# EAGLE design snarfbasebasics232-v03g (EAGLE 5.11)
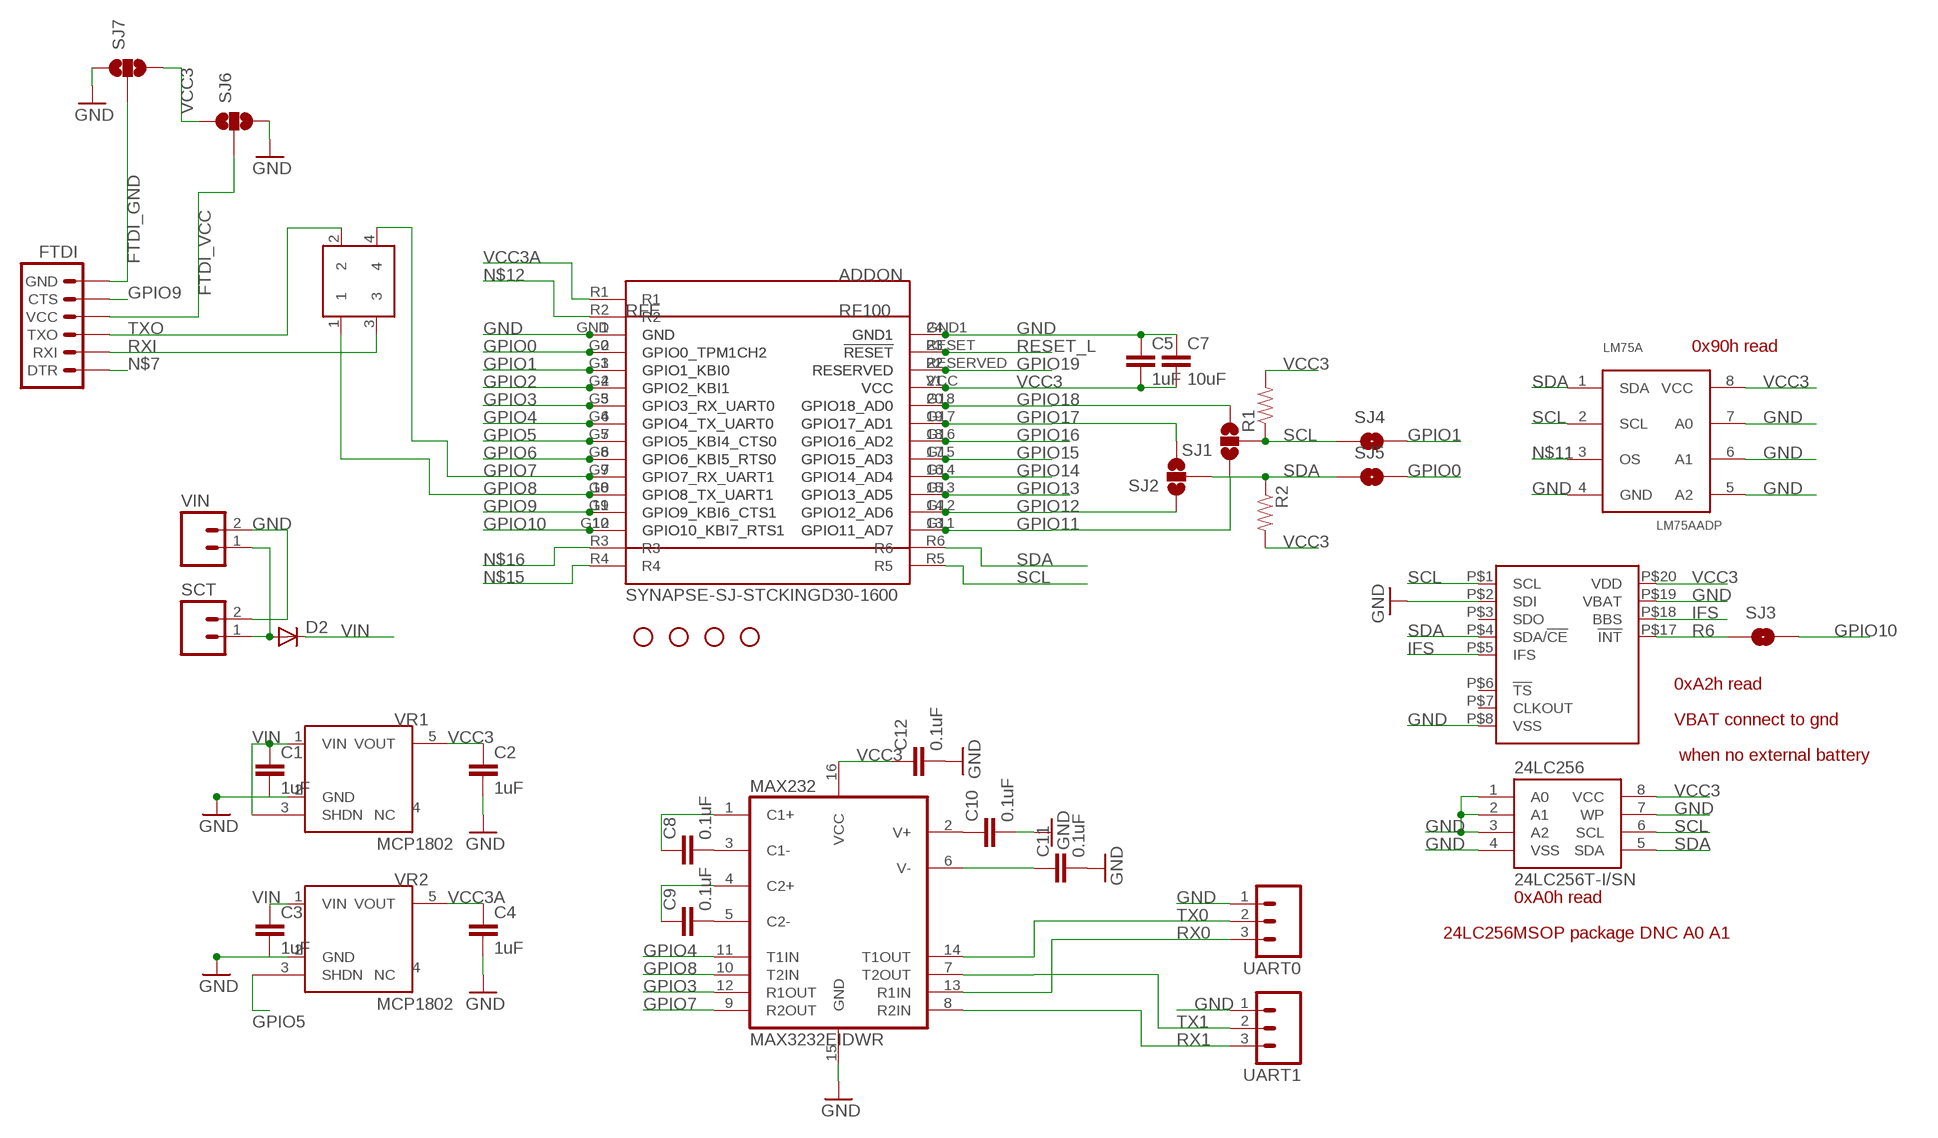
[diagram p0: schematic, sheet 1]

## Parts
24LC256  24LC256T-I/SN  EEPROM-I2CSMD  [SO08]
ADDON  SYNAPSE-SJ-STCKINGD30-1600  [SYNSJ-STACK]
C1  1uF  CAP0805  [0805]
C2  1uF  CAP0805  [0805]
C3  1uF  CAP0805  [0805]
C4  1uF  CAP0805  [0805]
C5  1uF  CAP0805  [0805]
C7  10uF  CAP0805  [0805]
C8  0.1uF  CAP0805  [0805]
C9  0.1uF  CAP0805  [0805]
C10  0.1uF  CAP0805  [0805]
C11  0.1uF  CAP0805  [0805]
C12  0.1uF  CAP0805  [0805]
D2  DIODESMA  [SMA-DIODE]
FTDI  ARDUINO_SERIAL_PROGRAMPTH  [1X06]
JP6  STAND-OFF  [STAND-OFF]
JP9  STAND-OFF  [STAND-OFF]
JP10  STAND-OFF  [STAND-OFF]
JP11  STAND-OFF  [STAND-OFF]
LM75A  LM75AADP  [TSSOP8]
MAX232  MAX3232EIDWR  MAX232SOIC16  [SO016]
PCF2129A  PCF2129ASO20  [SO20W]
R1  RESISTOR  [0805]
R2  RESISTOR  [0805]
RFE  RFE  RF100-JACKJACK2  [SYNAPSERFENGINE-THM-SMT-JACK2]
RXTX  SERIAL_CROSSOVER  [2X02_PTH]
SCT  M023.5MM  [SCREWTERMINAL-3.5MM-2]
SJ1  SOLDERJUMPER_2WAYS  [SJ_3]
SJ2  SOLDERJUMPER_2WAYS  [SJ_3]
SJ3  SOLDERJUMPERNC2  [SJ_2S-NOTRACE]
SJ4  SOLDERJUMPERNO  [SJ_2S-NO]
SJ5  SOLDERJUMPERNO  [SJ_2S-NO]
SJ6  SOLDERJUMPER_2WAYPASTE1&2  [SJ_3_PASTE1&2]
SJ7  SOLDERJUMPER_2WAYPASTE1&2  [SJ_3_PASTE1&2]
UART0  M03PTH  [1X03]
UART1  M03PTH  [1X03]
VIN  M02PTH  [1X02]
VR1  MCP1802  [SOT23-5]
VR2  MCP1802  [SOT23-5]

## Nets
FTDI_GND: FTDI.6(GND) SJ7.2
FTDI_VCC: FTDI.4(VCC) SJ6.2
GND: 24LC256.1(A0) 24LC256.2(A1) 24LC256.3(A2) 24LC256.4(VSS) 24LC256.7(WP) ADDON.GND ADDON.GND1 C1.2 C2.2 C3.2 C4.2 C5.1 C7.1 C10.2 C11.2 C12.2 LM75A.4(GND) LM75A.5(A2) LM75A.6(A1) LM75A.7(A0) MAX232.15(GND) PCF2129A.P$2(SDI) PCF2129A.P$8(VSS) PCF2129A.P$19(VBAT) RFE.1(GND) RFE.24(GND1) RFE.P1 RFE.P24 RFE.P201 RFE.P224 SCT.2 SJ6.3 SJ7.1 UART0.1 UART1.1 VIN.2 VR1.2(GND) VR2.2(GND)
GPIO0: ADDON.G0(GPIO0_TPM1CH2) RFE.2(GPIO0_TPM1CH2) RFE.P2 RFE.P202 SJ5.2
GPIO1: ADDON.G1(GPIO1_KBI0) RFE.3(GPIO1_KBI0) RFE.P3 RFE.P203 SJ4.2
GPIO2: ADDON.G2(GPIO2_KBI1) RFE.4(GPIO2_KBI1) RFE.P4 RFE.P204
GPIO3: ADDON.G3(GPIO3_RX_UART0) MAX232.12(R1OUT) RFE.5(GPIO3_RX_UART0) RFE.P5 RFE.P205
GPIO4: ADDON.G4(GPIO4_TX_UART0) MAX232.11(T1IN) RFE.6(GPIO4_TX_UART0) RFE.P6 RFE.P206
GPIO5: ADDON.G5(GPIO5_KBI4_CTS0) RFE.7(GPIO5_KBI4_CTS0) RFE.P7 RFE.P207 VR2.3(SHDN)
GPIO6: ADDON.G6(GPIO6_KBI5_RTS0) RFE.8(GPIO6_KBI5_RTS0) RFE.P8 RFE.P208
GPIO7: ADDON.G7(GPIO7_RX_UART1) MAX232.9(R2OUT) RFE.9(GPIO7_RX_UART1) RFE.P9 RFE.P209 RXTX.4
GPIO8: ADDON.G8(GPIO8_TX_UART1) MAX232.10(T2IN) RFE.10(GPIO8_TX_UART1) RFE.P10 RFE.P210 RXTX.1
GPIO9: ADDON.G9(GPIO9_KBI6_CTS1) FTDI.5(CTS) RFE.11(GPIO9_KBI6_CTS1) RFE.P11 RFE.P211
GPIO10: ADDON.G10(GPIO10_KBI7_RTS1) RFE.12(GPIO10_KBI7_RTS1) RFE.P12 RFE.P212 SJ3.2
GPIO11: ADDON.G11(GPIO11_AD7) RFE.13(GPIO11_AD7) RFE.P13 RFE.P213 SJ1.1
GPIO12: ADDON.G12(GPIO12_AD6) RFE.14(GPIO12_AD6) RFE.P14 RFE.P214 SJ2.1
GPIO13: ADDON.G13(GPIO13_AD5) RFE.15(GPIO13_AD5) RFE.P15 RFE.P215
GPIO14: ADDON.G14(GPIO14_AD4) RFE.16(GPIO14_AD4) RFE.P16 RFE.P216
GPIO15: ADDON.G15(GPIO15_AD3) RFE.17(GPIO15_AD3) RFE.P17 RFE.P217
GPIO16: ADDON.G16(GPIO16_AD2) RFE.18(GPIO16_AD2) RFE.P18 RFE.P218
GPIO17: ADDON.G17(GPIO17_AD1) RFE.19(GPIO17_AD1) RFE.P19 RFE.P219 SJ2.3
GPIO18: ADDON.G18(GPIO18_AD0) RFE.20(GPIO18_AD0) RFE.P20 RFE.P220 SJ1.3
GPIO19: ADDON.RESERVED RFE.22(RESERVED) RFE.P22 RFE.P222
IFS: PCF2129A.P$5(IFS) PCF2129A.P$18(BBS)
N$1: C8.2 MAX232.3(C1-)
N$2: D2.A SCT.1 VIN.1
N$4: C9.2 MAX232.5(C2-)
N$5: C10.1 MAX232.2(V+)
N$6: C11.1 MAX232.6(V-)
N$7: FTDI.1(DTR)
N$8: C8.1 MAX232.1(C1+)
N$10: C9.1 MAX232.4(C2+)
N$11: LM75A.3(OS)
N$12: ADDON.R2
N$15: ADDON.R4
N$16: ADDON.R3
R6: PCF2129A.P$17(!INT) SJ3.1
RESET_L: ADDON.RESET(!RESET) RFE.23(!RESET) RFE.P23 RFE.P223
RX0: MAX232.13(R1IN) UART0.3
RX1: MAX232.8(R2IN) UART1.3
RXI: FTDI.2(RXI) RXTX.3
SCL: 24LC256.6(SCL) ADDON.R5 LM75A.2(SCL) PCF2129A.P$1(SCL) R1.1 SJ1.2 SJ4.1
SDA: 24LC256.5(SDA) ADDON.R6 LM75A.1(SDA) PCF2129A.P$4(SDA/!CE) R2.1 SJ2.2 SJ5.1
TX0: MAX232.14(T1OUT) UART0.2
TX1: MAX232.7(T2OUT) UART1.2
TXO: FTDI.3(TXO) RXTX.2
VCC3: 24LC256.8(VCC) ADDON.VCC C2.1 C5.2 C7.2 C12.1 LM75A.8(VCC) MAX232.16(VCC) PCF2129A.P$20(VDD) R1.2 R2.2 RFE.21(VCC) RFE.P21 RFE.P221 SJ6.1 SJ7.3 VR1.5(VOUT)
VCC3A: ADDON.R1 C4.1 VR2.5(VOUT)
VIN: C1.1 C3.1 D2.C VR1.1(VIN) VR1.3(SHDN) VR2.1(VIN)
Unconnected: PCF2129A.P$3(SDO) PCF2129A.P$6(!TS) PCF2129A.P$7(CLKOUT) VR1.4(NC) VR2.4(NC)

## Notes on the sheet
- 0x90h read
- 0xA2h read
- VBAT connect to gnd
- when no external battery
- 0xA0h read
- 24LC256MSOP package DNC A0 A1

## Library data of the parts
24LC256 = SparkFun:EEPROM-I2C
ADDON = 0_jc-custom:SYNAPSE-SJ-STCKING: Standard layout for expansion modules using Synapse Wireless boards
C1-C5 C7-C12 = 0_jc-custom:CAP: Capacitor Standard 0603 ceramic capacitor, and 0.1" leaded capacitor.
D2 = SparkFun:DIODE: Diode These are standard reverse protection diodes and small signal diodes. SMA package can handle up to about 1A. SOD-323 can handle about 200mA. What the SOD-323 package when ordering, there are some mfgs out there that are 5-pin packages.
FTDI = SparkFun:ARDUINO_SERIAL_PROGRAM
JP6 JP9-JP11 = SparkFun:STAND-OFF: Stand Off This is the mechanical footprint for a #4 phillips button head screw. Use the keepout ring to avoid running the screw head into surrounding components. SKU : PRT-00447
LM75A = 0_jc-custom:LM75A
MAX232 = SparkFun:MAX232: RS232 Transceiver Very common IC. This is generically called 'MAX232', but works with the 3V equivalent MAX3232 generic ICs. Field tested and mother approved. Spark Fun Electronics SKU : COM-00316 (DIP) and COM-00589 (SMD)
PCF2129A = 0_jc-custom:PCF2129A
R1 R2 = SparkFun:RESISTOR: Resistor Basic schematic elements and footprints for 0603, 1206, and PTH 1/10th watt (small) resistors.
RFE = 0_jc-custom:RF100-JACK
RXTX = 0_jc-custom:SERIAL_CROSSOVER
SCT VIN = SparkFun:M02: Header 2 Standard 2-pin 0.1" header. Use with straight break away headers (SKU : PRT-00116), right angle break away headers (PRT-00553), swiss pins (PRT-00743), machine pins (PRT-00117), and female headers (PRT-00115). Molex polarized connector foot print use with SKU : PRT-08233 with associated crimp pins and housings.
SJ1 SJ2 SJ6 SJ7 = SparkFun:SOLDERJUMPER_2WAY: Solder Jumper 2 way solder jumper
SJ3-SJ5 = SparkFun:SOLDERJUMPER: Solder Jumper Standard SMD solder jumper. Used to automate production. Two varients : Normally Open and Normally Closed are the same, but have different paste layers. NC will have a large amount of paste and should jumper during reflow.
UART0 UART1 = SparkFun:M03: Header 3 Standard 3-pin 0.1" header. Use with straight break away headers (SKU : PRT-00116), right angle break away headers (PRT-00553), swiss pins (PRT-00743), machine pins (PRT-00117), and female headers (PRT-00115). Molex polarized connector foot print use with SKU : PRT-08232 with associated crimp pins and housings.
VR1 VR2 = 0_jc-custom:MCP1802

## Net classes
0 default: width 0.356 mm
1 Power: width 0.508 mm
2 smallsignal: width 0.152 mm
3 stdsignal: width 0.254 mm

## Board
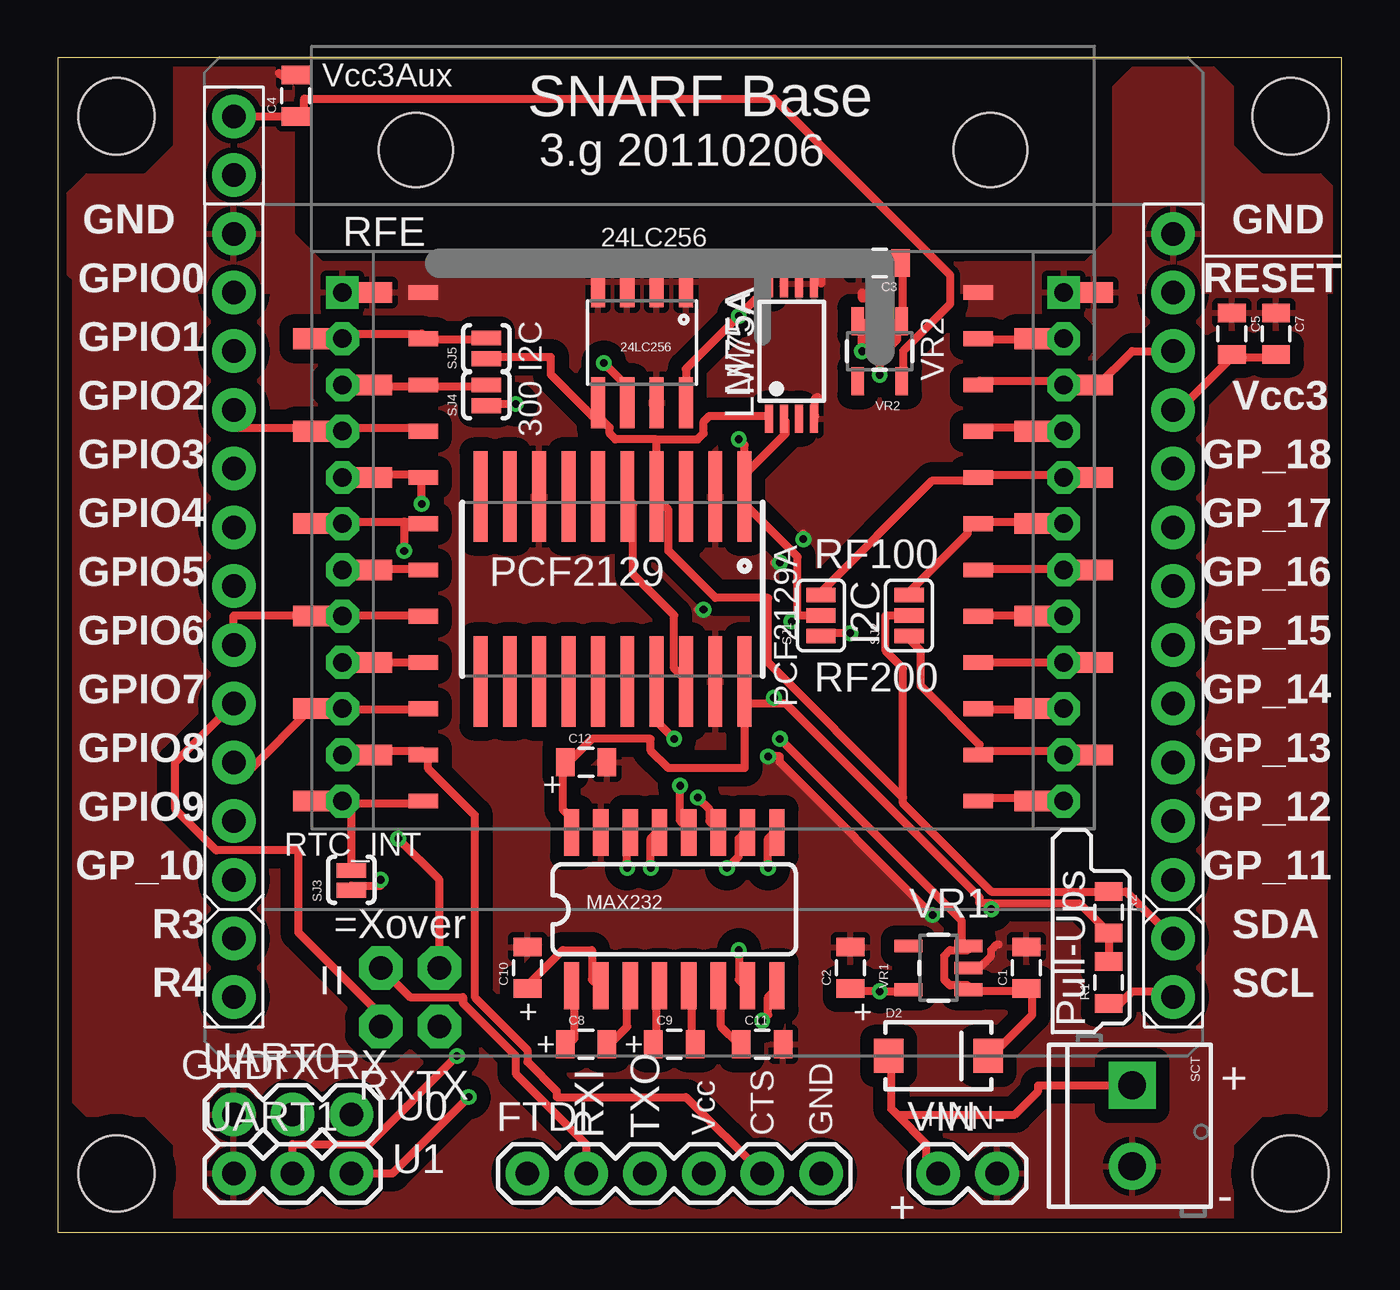
[diagram p1: board, top side]
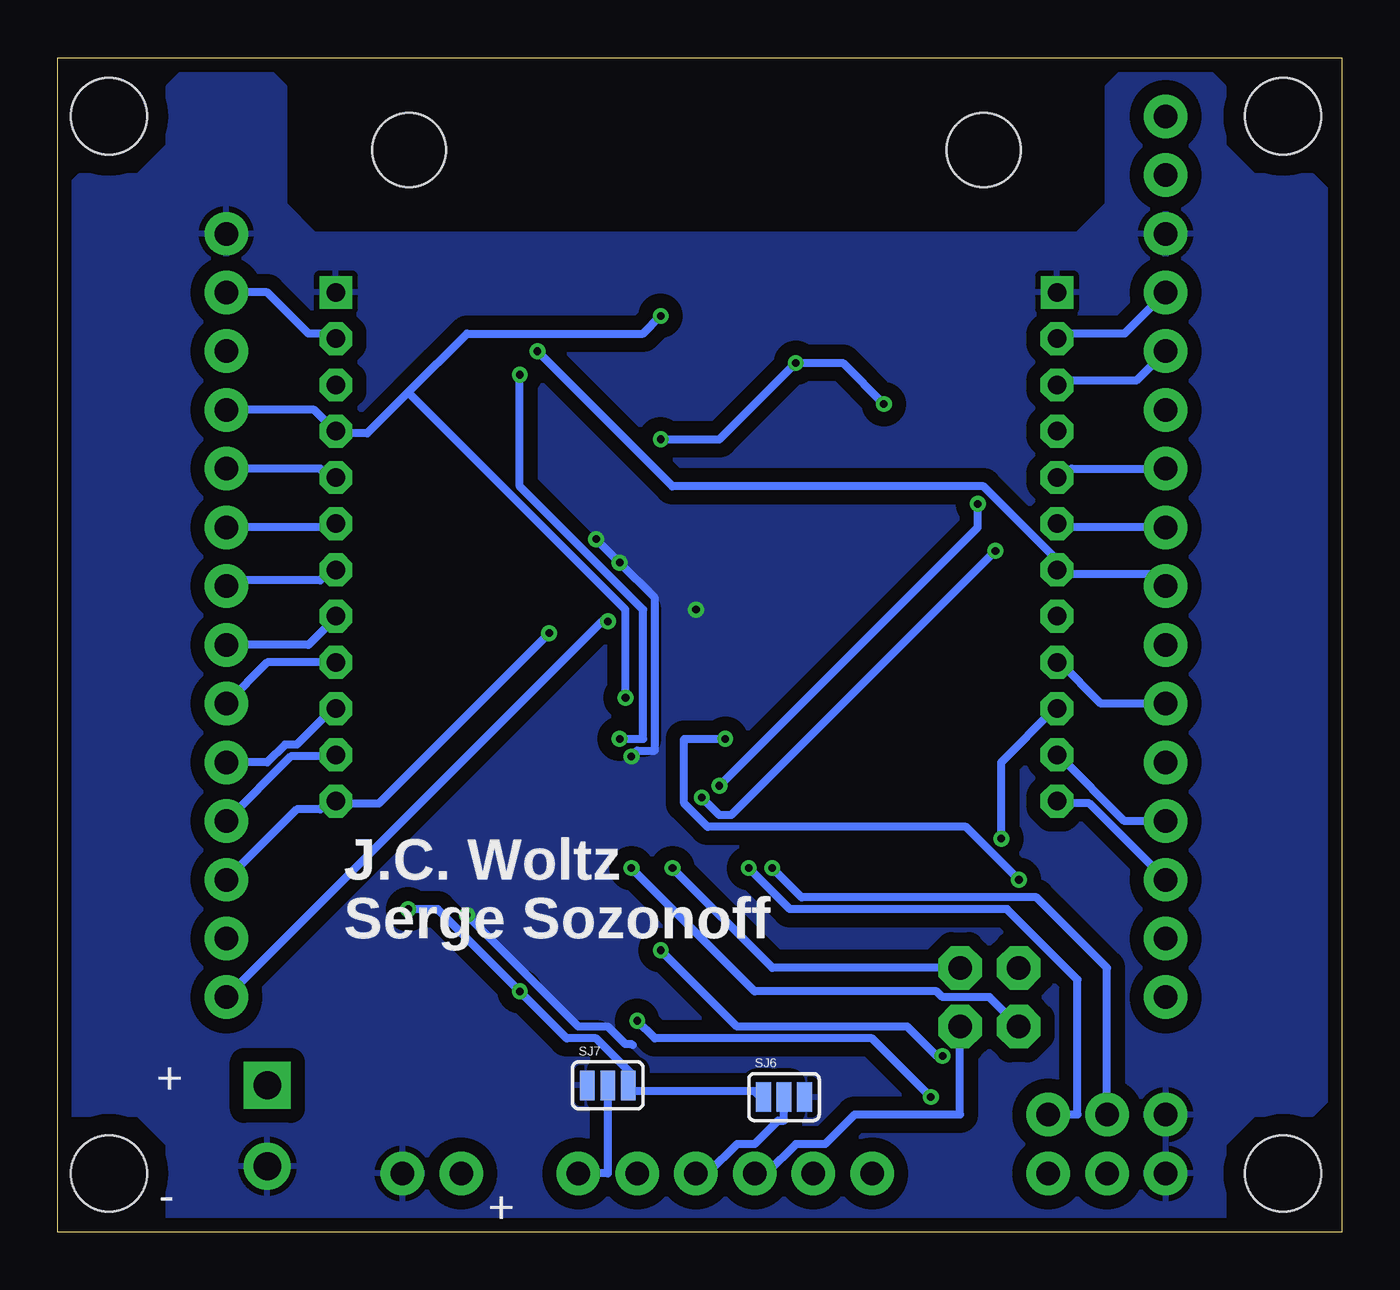
[diagram p2: board, bottom side, seen from below]

Size 55.55 x 50.79 mm. Coordinates in mm from the lower left corner, seen from the top.
Outline: 0,0 55.55,0 55.55,50.79 0,50.79 0,0
Copper layers (1*16): Top 0.0356mm / dielectric 1.5011mm / Bottom 0.0356mm
Design rules "LaenPCBOrder-JCModified": minimum track width 6mil, minimum drill 13mil, track to track 6mil, track to pad 6mil, pad to pad 6mil, via to via 6mil, smd to smd 6mil, copper to edge 15mil, drill to drill 6mil, minimum pad ring 12mil, minimum via ring 7mil, stop-mask expansion 4mil, vias tented up to drill 25mil, thermal gap 10mil

### Footprints (pad centres in the part's own frame; a part is rotated, then mirrored left to right if it is on the bottom)
SO08 = smd 0.61 x 2.21: 1 -1.905,-2.616; 2 -0.635,-2.616; 3 0.635,-2.616; 4 1.905,-2.616; 5 1.905,2.616; 6 0.635,2.616; 7 -0.635,2.616; 8 -1.905,2.616
SYNSJ-STACK = drill 1.016 pad 1.88 round: G0 0,-7.62; G1 0,-10.16; G2 0,-12.7; G3 0,-15.24; G4 0,-17.78; G5 0,-20.32; G6 0,-22.86; G7 0,-25.4; G8 0,-27.94; G9 0,-30.48; G10 0,-33.02; G11 40.64,-33.02; G12 40.64,-30.48; G13 40.64,-27.94; G14 40.64,-25.4; G15 40.64,-22.86; G16 40.64,-20.32; G17 40.64,-17.78; G18 40.64,-15.24; GND 0,-5.08; GND1 40.64,-5.08; R1 0,0; R2 0,-2.54; R3 0,-35.56; R4 0,-38.1; R5 40.64,-38.1; R6 40.64,-35.56; RESERVED 40.64,-10.16; RESET 40.64,-7.62; VCC 40.64,-12.7
0805 = smd 0.8 x 1.2: 1 -0.9,0; 2 0.9,0
SMA-DIODE = smd 1.27 x 1.47: A -2.15,0; C 2.15,0
1X06 = drill 1.016 pad 1.88 round: 1 0,0; 2 2.54,0; 3 5.08,0; 4 7.62,0; 5 10.16,0; 6 12.7,0
STAND-OFF = hole 3.302: 0,0
TSSOP8 = smd 1.2 x 0.35: 1 -2.925,0.975; 2 -2.925,0.325; 3 -2.925,-0.325; 4 -2.925,-0.975; 5 2.925,-0.975; 6 2.925,-0.325; 7 2.925,0.325; 8 2.925,0.975
SO016 = smd 0.66 x 2.032: 1 -4.445,-3.315; 2 -3.175,-3.315; 3 -1.905,-3.315; 4 -0.635,-3.315; 5 0.635,-3.315; 6 1.905,-3.315; 7 3.175,-3.315; 8 4.445,-3.315; 9 4.445,3.315; 10 3.175,3.315; 11 1.905,3.315; 12 0.635,3.315; 13 -0.635,3.315; 14 -1.905,3.315; 15 -3.175,3.315; 16 -4.445,3.315
SO20W = smd 0.6 x 3.9: P$1 -5.715,-4; P$2 -4.445,-4; P$3 -3.175,-4; P$4 -1.905,-4; P$5 -0.635,-4; P$6 0.635,-4; P$7 1.905,-4; P$8 3.175,-4; P$9 4.445,-4; P$10 5.715,-4; P$11 5.715,4; P$12 4.445,4; P$13 3.175,4; P$14 1.905,4; P$15 0.635,4; P$16 -0.635,4; P$17 -1.905,4; P$18 -3.175,4; P$19 -4.445,4; P$20 -5.715,4
SYNAPSERFENGINE-THM-SMT-JACK2 = drill 0.8 square: 1 0,0; 24 31.2,0 | drill 0.8 pad 1.422 octagon: 2 0,-2; 3 0,-4; 4 0,-6; 5 0,-8; 6 0,-10; 7 0,-12; 8 0,-14; 9 0,-16; 10 0,-18; 11 0,-20; 12 0,-22; 13 31.2,-22; 14 31.2,-20; 15 31.2,-18; 16 31.2,-16; 17 31.2,-14; 18 31.2,-12; 19 31.2,-10; 20 31.2,-8; 21 31.2,-6; 22 31.2,-4; 23 31.2,-2 | smd 1.67 x 0.89: P1 1.3,0; P2 -1.3,-2; P3 1.3,-4; P4 -1.3,-6; P5 1.3,-8; P6 -1.3,-10; P7 1.3,-12; P8 -1.3,-14; P9 1.3,-16; P10 -1.3,-18; P11 1.3,-20; P12 -1.3,-22; P13 29.9,-22; P14 32.5,-20; P15 29.9,-18; P16 32.5,-16; P17 29.9,-14; P18 32.5,-12; P19 29.9,-10; P20 32.5,-8; P21 29.9,-6; P22 32.5,-4; P23 29.9,-2; P24 32.5,0 | smd 1.27 x 0.635: P201 3.5,0; P202 3.5,-2; P203 3.5,-4; P204 3.5,-6; P205 3.5,-8; P206 3.5,-10; P207 3.5,-12; P208 3.5,-14; P209 3.5,-16; P210 3.5,-18; P211 3.5,-20; P212 3.5,-22; P213 27.5,-22; P214 27.5,-20; P215 27.5,-18; P216 27.5,-16; P217 27.5,-14; P218 27.5,-12; P219 27.5,-10; P220 27.5,-8; P221 27.5,-6; P222 27.5,-4; P223 27.5,-2; P224 27.5,0 | hole 3.2: 3.17,6.16; 28.03,6.16
2X02_PTH = drill 1.016 pad 1.88 octagon: 1 -1.27,-1.27; 2 -1.27,1.27; 3 1.27,-1.27; 4 1.27,1.27
SCREWTERMINAL-3.5MM-2 = drill 1.2 pad 2.032 square: 1 0,0 | drill 1.2 pad 2.032 round: 2 3.5,0
SJ_3 = smd 0.635 x 1.27: 1 -0.889,0; 2 0,0; 3 0.889,0
SJ_2S-NOTRACE = smd 0.635 x 1.27: 1 -0.45,0; 2 0.4,0
SJ_2S-NO = smd 0.635 x 1.27: 1 -0.45,0; 2 0.45,0
SJ_3_PASTE1&2 = smd 0.635 x 1.27: 1 -0.889,0; 2 0,0; 3 0.889,0
1X03 = drill 1.016 pad 1.88 round: 1 0,0; 2 2.54,0; 3 5.08,0
1X02 = drill 1.016 pad 1.88 round: 1 0,0; 2 2.54,0
SOT23-5 = smd 0.55 x 1.2: 1 -0.95,-1.3; 2 0,-1.3; 3 0.95,-1.3; 4 0.95,1.3; 5 -0.95,1.3

### Placement (x,y rotation side)
24LC256  25.27,38.48 180 top
ADDON  7.62,48.26 0 top
C1  41.91,11.43 90 top
C2  34.29,11.43 90 top
C3  35.56,41.91 180 top
C4  10.29,49.15 90 top
C5  50.8,38.86 270 top
C7  52.7,38.86 270 top
C8  22.86,8.13 0 top
C9  26.67,8.13 0 top
C10  20.32,11.43 90 top
C11  30.48,8.13 0 top
C12  22.86,20.32 0 top
D2  38.1,7.62 0 top
FTDI  20.32,2.54 0 top
JP6  53.34,2.54 0 top
JP9  2.54,2.54 0 top
JP10  53.34,48.26 0 top
JP11  2.54,48.26 0 top
LM75A  31.75,38.1 90 top
MAX232  26.67,13.97 0 top
PCF2129A  24,27.81 180 top
R1  45.47,10.79 90 top
R2  45.47,13.84 270 top
RFE  12.32,40.64 0 top
RXTX  15.24,10.16 180 top
SCT  46.48,6.35 270 top
SJ1  33.02,26.67 90 top
SJ2  36.83,26.67 90 top
SJ3  12.7,15.24 90 top
SJ4  18.54,36.2 90 top
SJ5  18.54,38.23 90 top
SJ6  24.13,5.84 0 bottom
SJ7  31.75,6.35 0 bottom
UART0  7.62,5.08 0 top
UART1  7.62,2.54 0 top
VIN  38.1,2.54 0 top
VR1  38.1,11.43 90 top
VR2  35.56,38.1 180 top

### Tracks (layer width: path | path; a pad name or v marks a point on that pad's centre or on a via)
FTDI_GND
  Bottom 0.356: SJ7.2 31.75,2.54 FTDI.6
FTDI_VCC
  Bottom 0.356: SJ6.2 24.13,4.83 24.38,4.83 25.4,3.81 26.16,3.81 27.43,2.54 FTDI.4
GND  (via drill 0.33)
  Top 0.356: VR1.2 39.62,11.43 39.88,11.43 40.39,11.94 40.39,12.19 40.64,12.45 40.71,12.45 | C4.2 10.16,50.04 9.65,50.04 9.57,50.12 | LM75A.4 32.77,35.31 32.77,36.07 32.87,36.13 | 34.8,40.64 34.8,40.39 35.05,40.39 35.56,39.88 35.56,39.62 VR2.2 | 30.23,41.91 30.23,42.16 32.51,42.16 33.02,41.66 33.02,41.15 33.02,41.02 | v32.26,29.97 32.26,30.23 | v31.24,28.96 30.99,28.96 | v30.73,20.57 31.24,20.57 31.24,20.32 v37.85,13.72 | 27.69,26.92 v27.94,26.92
  Bottom 0.356: v32.26,29.97 v31.24,28.96 29.72,27.43 29.72,20.83 30.48,20.83 v30.73,20.57 | v37.85,13.72 33.02,8.89 31.75,8.89 30.99,8.13 30.73,8.13 30.68,8.09
  pour Top (isolate 0.61): 0,41.91 0,6.35 1.27,5.08 3.81,5.08 5.08,3.81 5.08,0 50.8,0 50.8,3.81 52.07,5.08 54.61,5.08 55.88,6.35 55.88,41.91
  pour Top (isolate 0.254): 0,41.91 0,44.45 1.27,45.72 3.81,45.72 5.08,46.99 5.08,50.8 8.89,50.8 10.16,49.53 10.16,43.18 11.43,41.91 44.45,41.91 45.72,43.18 45.72,49.53 46.99,50.8 49.53,50.8 50.8,49.53 50.8,46.99 52.07,45.72 54.61,45.72 55.88,44.45 55.88,40.64 1.27,40.64
  pour Bottom (isolate 0.61): 0,44.45 0,6.35 1.27,5.08 3.81,5.08 5.08,3.81 5.08,0 50.8,0 50.8,3.81 52.07,5.08 55.88,5.08 55.88,44.45 54.61,45.72 52.07,45.72 50.8,46.99 50.8,49.53 49.53,50.8 46.99,50.8 45.72,49.53 45.72,44.45 44.45,43.18 11.43,43.18 10.16,44.45 10.16,49.53 8.89,50.8 6.35,50.8 5.08,49.53 5.08,46.99 3.81,45.72 1.27,45.72
GPIO0
  Top 0.356: SJ5.2 18.54,38.61 16,38.61 RFE.P202 15.75,38.86 12.45,38.86 RFE.2 12.19,38.61 11.18,38.61 RFE.P2
  Bottom 0.356: ADDON.G0 9.4,38.86 12.19,38.86 RFE.2
GPIO1
  Top 0.356: SJ4.2 18.54,36.58 16,36.58 RFE.P203 15.75,36.58 13.72,36.58 RFE.P3 13.46,36.83 12.45,36.83 RFE.3
  Bottom 0.356: ADDON.G1 8.89,36.83 12.19,36.83 RFE.3
GPIO2
  Top 0.356: RFE.P204 15.75,34.8 12.45,34.8 RFE.4 12.19,34.8 11.18,34.8 RFE.P4 10.92,34.8 7.62,34.8 ADDON.G2
GPIO3  (via drill 0.33)
  Top 0.356: v26.92,19.3 26.92,17.78 27.18,17.53 MAX232.12 | v15.75,31.5 15.75,32.51 RFE.P205 15.75,32.77 13.72,32.77 RFE.P5 13.46,32.77 12.45,32.77 RFE.5
  Bottom 0.356: v26.92,19.3 15.75,30.48 v15.75,31.5 | ADDON.G3 11.68,33.02 11.94,32.77 12.19,32.77 RFE.5
GPIO4  (via drill 0.33)
  Top 0.356: 14.99,30.73 12.45,30.73 RFE.6 12.19,30.73 11.18,30.73 RFE.P6 | 14.99,30.73 15.75,30.73 RFE.P206 | v27.69,18.8 28.19,18.29 28.19,17.78 28.45,17.53 MAX232.11 | 14.99,30.73 v14.99,29.46
  Bottom 0.356: v27.69,18.8 26.92,18.03 26.42,18.03 v14.99,29.46 | ADDON.G4 12.19,30.48 RFE.6
GPIO5  (via drill 0.33)
  Top 0.356: RFE.P207 15.75,28.7 13.72,28.7 RFE.P7 13.46,28.7 12.45,28.7 RFE.7 | v34.8,38.1 34.8,39.37 VR2.3
  Bottom 0.356: v34.8,38.1 28.96,32.26 15.49,32.26 12.45,29.21 12.45,28.7 RFE.7 12.19,28.45 8.13,28.45 ADDON.G5
GPIO6
  Top 0.356: RFE.P208 15.75,26.67 12.45,26.67 RFE.8 12.19,26.67 11.18,26.67 RFE.P8 10.92,26.67 7.62,26.67 ADDON.G6
GPIO7  (via drill 0.33)
  Top 0.356: RFE.P209 15.75,24.64 13.72,24.64 RFE.P9 13.46,24.64 12.45,24.64 RFE.9 | v30.73,15.75 30.73,17.02 30.99,17.27 MAX232.9 | ADDON.G7 5.08,20.32 5.08,18.29 6.86,16.51 10.41,16.51 10.41,12.95 13.97,9.4 RXTX.4
  Bottom 0.356: ADDON.G7 10.41,22.86 12.19,24.64 RFE.9 | v30.73,15.75 25.4,10.41 17.53,10.41 17.27,10.16 15.24,10.16 RXTX.4
GPIO8  (via drill 0.33)
  Top 0.356: RFE.P210 15.75,22.61 12.45,22.61 RFE.10 12.19,22.61 11.18,22.61 RFE.P10 10.92,22.61 8.38,20.07 7.62,20.07 ADDON.G8 | v28.96,15.75 29.46,16.26 29.46,17.02 29.72,17.27 MAX232.10 | v14.73,17.02 16.51,15.24 RXTX.1
  Bottom 0.356: v28.96,15.75 24.64,11.43 RXTX.1 | v14.73,17.02 14.73,20.32 12.45,22.61 RFE.10
GPIO9
  Top 0.356: RFE.11 12.45,20.57 13.46,20.57 RFE.P11 13.72,20.83 15.75,20.83 RFE.P211 16,20.57 16,20.07 18.03,18.03 18.03,10.16 20.32,7.87 20.32,7.37 21.59,6.1 21.59,5.84 27.18,5.84 FTDI.5
  Bottom 0.356: ADDON.G9 9.4,17.78 12.19,20.57 RFE.11
GPIO10
  Top 0.356: 12.45,18.54 12.7,18.29 12.7,15.75 SJ3.2 | RFE.12 12.45,18.54 | 12.45,18.54 15.75,18.54 RFE.P212 | RFE.12 12.45,18.54 | RFE.P12 11.18,18.8 12.19,18.8 RFE.12
  Bottom 0.356: ADDON.G10 10.92,18.54 12.19,18.54 RFE.12
GPIO11  (via drill 0.33)
  Top 0.356: RFE.P213 39.88,18.8 42.16,18.8 RFE.P13 42.42,18.8 43.43,18.8 RFE.13 | v34.29,25.91 33.02,25.91 SJ1.1
  Bottom 0.356: v34.29,25.91 41.66,18.54 43.43,18.54 RFE.13 43.69,18.54 43.94,18.54 44.2,18.29 45.21,18.29 ADDON.G11
GPIO12
  Top 0.356: RFE.P14 44.7,20.57 43.69,20.57 RFE.14 43.43,20.83 39.88,20.83 | 39.88,20.83 39.88,21.08 37.34,23.62 37.34,25.15 36.83,25.65 SJ2.1 | 39.88,20.83 RFE.P214 39.88,20.83
  Bottom 0.356: ADDON.G12 45.47,20.57 43.69,20.57 RFE.14
GPIO13
  Top 0.356: RFE.P215 39.88,22.61 42.16,22.61 RFE.P15 42.42,22.61 43.43,22.61 RFE.15
  Bottom 0.356: ADDON.G13 46.48,20.32 45.72,21.08 45.21,21.08 43.69,22.61 RFE.15
GPIO14
  Top 0.356: RFE.P216 39.88,24.64 43.43,24.64 RFE.16 43.69,24.64 44.7,24.64 RFE.P16
  Bottom 0.356: ADDON.G14 46.48,24.64 43.69,24.64 RFE.16
GPIO15
  Top 0.356: RFE.P217 39.88,26.67 42.16,26.67 RFE.P17 42.42,26.67 43.43,26.67 RFE.17
  Bottom 0.356: ADDON.G15 44.7,25.4 43.69,26.42 RFE.17
GPIO16
  Top 0.356: RFE.P218 39.88,28.7 43.43,28.7 RFE.18 43.69,28.7 44.7,28.7 RFE.P18
  Bottom 0.356: ADDON.G16 48.01,28.19 44.2,28.19 43.94,28.45 43.69,28.45 RFE.18
GPIO17
  Top 0.356: RFE.19 43.43,30.73 42.42,30.73 RFE.P19 42.16,30.73 39.88,30.73 RFE.P219 39.62,30.73 39.37,30.48 39.37,30.23 36.83,27.69 SJ2.3
  Bottom 0.356: ADDON.G17 43.69,30.48 RFE.19
GPIO18
  Top 0.356: RFE.P20 44.7,32.77 43.69,32.77 RFE.20 43.43,32.77 39.88,32.77 RFE.P220 39.62,32.51 37.85,32.51 33.02,27.69 SJ1.3
  Bottom 0.356: ADDON.G18 44.2,33.02 43.94,32.77 43.69,32.77 RFE.20
GPIO19
  Top 0.356: RFE.P222 39.88,36.83 43.43,36.83 RFE.22 43.69,36.58 44.7,36.58 RFE.P22 44.96,36.58 46.48,38.1 ADDON.RESERVED
IFS
  Top 0.356: PCF2129A.P$18 27.18,23.88 26.67,24.38 26.67,26.67 24.89,28.45 24.89,31.5 24.64,31.75 PCF2129A.P$5
N$1
  Top 0.356: C8.2 23.88,8.13 24.64,8.89 24.64,10.41 MAX232.3
N$2
  Top 0.356: 36.32,5.08 37.59,3.81 37.59,3.05 VIN.1 | 36.32,5.08 36.07,5.33 36.07,7.62 D2.A | SCT.1 42.42,6.35 42.42,6.1 41.4,5.08 36.32,5.08
N$4
  Top 0.356: C9.2 27.43,8.13 27.43,10.41 MAX232.5
N$5
  Top 0.356: C10.1 20.32,10.67 21.84,12.19 23.11,12.19 23.11,10.92 23.37,10.67 MAX232.2
N$6
  Top 0.356: C11.1 29.46,8.13 28.7,8.89 28.7,10.41 MAX232.6
N$8
  Top 0.356: C8.1 22.1,8.13 22.35,8.38 22.35,10.41 MAX232.1
N$10
  Top 0.356: C9.1 25.91,8.13 25.91,10.41 MAX232.4
R6  (via drill 0.33)
  Top 0.356: v13.97,15.24 13.97,14.99 12.7,14.99 SJ3.1 | v26.67,21.34 25.91,22.1 25.91,23.62 PCF2129A.P$17
  Bottom 0.356: v13.97,15.24 16.26,17.53 27.43,17.53 28.45,18.54 28.45,21.34 v26.67,21.34
RESET_L
  Top 0.356: RFE.P223 39.88,38.61 42.16,38.61 RFE.P23 42.42,38.61 43.43,38.61 RFE.23
  Bottom 0.356: ADDON.RESET 46.48,40.64 44.7,38.86 43.69,38.86 RFE.23
RX0  (via drill 0.33)
  Top 0.356: v25.65,15.75 25.65,17.02 25.91,17.27 MAX232.13
  Bottom 0.356: v25.65,15.75 23.88,13.97 14.48,13.97 11.43,10.92 11.43,5.08 UART0.3
RX1  (via drill 0.33)
  Top 0.356: v30.48,9.14 30.73,9.4 30.73,10.16 30.99,10.41 MAX232.8 | v17.78,5.84 14.48,2.54 UART1.3
  Bottom 0.356: v30.48,9.14 29.72,8.38 20.32,8.38 v17.78,5.84
RXI
  Top 0.356: RXTX.3 15.24,10.16 17.53,10.16 17.53,9.91 19.81,7.62 19.81,6.86 22.86,3.81 FTDI.2
SCL  (via drill 0.33)
  Top 0.356: v19.81,35.81 18.54,35.81 SJ4.1 | v23.62,37.59 24.64,36.58 24.64,36.07 24LC256.6 | ADDON.R5 48.26,10.41 46.48,10.41 45.97,9.91 45.47,9.91 R1.1 | 29.72,32.77 31.5,34.54 31.5,35.05 LM75A.2 | 29.72,32.77 29.72,32 PCF2129A.P$1 | 32,26.67 SJ1.2 | 32,26.67 32,29.21 29.72,31.5 29.72,31.75 PCF2129A.P$1 | v31.75,26.42 32,26.67 | v29.46,34.29 29.72,34.04 29.72,32.77 | PCF2129A.P$1 29.72,32.77
  Bottom 0.356: v19.81,35.81 21.59,37.59 v23.62,37.59 26.92,34.29 v29.46,34.29 | ADDON.R5 32,26.42 v31.75,26.42
SDA
  Top 0.356: 23.37,35.31 23.11,35.31 21.34,37.08 21.34,37.85 18.54,37.85 SJ5.1 | 23.37,35.31 23.37,35.81 24LC256.5 23.37,35.31 | 25.91,34.29 27.69,34.29 27.94,34.54 27.94,35.05 28.19,35.31 30.73,35.31 LM75A.1 | 25.91,34.29 25.91,32 PCF2129A.P$4 25.91,31.75 26.42,31.24 26.42,29.46 28.45,27.43 30.73,27.43 30.73,24.64 36.58,18.8 | 23.37,35.31 23.88,34.8 23.88,34.54 24.13,34.29 25.91,34.29 | R2.1 46.23,14.73 ADDON.R6 | R2.1 | SJ2.2 35.81,26.67 35.81,25.15 36.58,24.38 36.58,18.8 | 36.58,18.8 36.58,18.54 40.39,14.73 R2.1
TX0  (via drill 0.33)
  Top 0.356: v24.64,15.75 24.64,17.27 MAX232.14
  Bottom 0.356: v24.64,15.75 23.37,14.48 13.21,14.48 10.16,11.43 UART0.2
TX1  (via drill 0.33)
  Top 0.356: v29.46,12.19 29.46,10.92 29.72,10.67 MAX232.7 | v17.27,7.62 13.46,3.81 10.16,3.81 UART1.2
  Bottom 0.356: v29.46,12.19 26.16,8.89 18.8,8.89 17.53,7.62 v17.27,7.62
TXO
  Bottom 0.356: RXTX.2 16.51,5.08 21.08,5.08 22.35,3.81 23.62,3.81 24.89,2.54 FTDI.3
VCC3  (via drill 0.33)
  Top 0.356: LM75A.8 30.73,40.89 v29.46,39.62 27.18,37.34 27.18,36.07 24LC256.8 | RFE.P221 39.88,34.8 42.16,34.8 RFE.P21 42.42,34.8 43.43,34.8 RFE.21 | 50.8,37.85 52.58,37.85 C7.2 | 50.8,37.85 C5.2 50.8,37.85 | 50.8,37.85 48.51,35.56 ADDON.VCC | C2.1 34.29,10.41 v35.56,10.41 36.58,10.41 VR1.5 | MAX232.16 22.1,17.53 22.1,18.03 21.84,18.29 21.84,20.32 C12.1 22.1,20.32 23.11,21.34 25.65,21.34 25.65,20.83 26.42,20.07 29.72,20.07 29.72,22.86 | R1.2 45.47,11.94 45.47,12.7 R2.2 45.47,12.95 44.2,14.22 40.39,14.22 | 40.39,14.22 39.88,14.22 39.88,14.48 31.5,22.86 30.99,22.86 | 30.99,22.86 29.72,22.86 | 29.72,22.86 29.72,23.62 PCF2129A.P$20 29.72,22.86 | v40.39,13.97 40.39,14.22 | 30.99,22.86 v30.99,23.11
  Bottom 0.356: ADDON.VCC 44.45,35.56 43.69,34.8 RFE.21 43.43,34.54 42.16,34.54 40.39,36.32 | v29.46,39.62 30.23,38.86 37.85,38.86 40.39,36.32 | SJ6.1 25.15,5.84 25.4,6.1 30.73,6.1 30.99,6.35 SJ7.3 30.73,6.35 30.73,6.86 32.26,8.38 33.53,8.38 v35.56,10.41 39.12,13.97 v40.39,13.97 | 40.39,36.32 30.99,26.92 v30.99,23.11
VCC3A
  Top 0.356: VR2.5 36.58,36.83 36.58,38.1 38.61,40.13 38.61,41.4 30.99,49.02 10.67,49.02 10.67,48.51 10.41,48.26 C4.1 10.16,48.26 ADDON.R1
VIN  (via drill 0.33)
  Top 0.356: C3.1 36.58,41.91 36.58,39.62 VR2.1 36.32,39.37 36.32,38.61 35.56,37.85 v35.56,37.08 | 39.12,12.19 39.37,12.19 VR1.3 39.12,12.19 | 39.12,12.19 38.61,12.19 38.35,11.94 38.35,10.92 38.61,10.67 39.37,10.67 VR1.1 39.62,10.41 41.91,10.41 C1.1 41.91,10.67 42.16,10.41 42.16,9.4 40.39,7.62 D2.C | v31.24,21.34 39.12,13.46 39.12,12.19
  Bottom 0.356: v35.56,37.08 35.56,32.26 30.23,26.92 30.23,21.34 v31.24,21.34

### Text on the board
tPlace: Vcc3Aux | SNARF Base | 3.g 20110206 | GND | 24LC256 | GND | GPIO0 | LM75A | !RESET | GPIO1 | GPIO2 | VR2 | Vcc3 | GPIO3 | 300 I2C | GP_18 | GPIO4 | RF100 | GP_17 | GPIO5 | PCF2129 | GP_16 | GPIO6 | I2C | RF200 | GP_15 | GPIO7 | GP_14 | GPIO8 | GP_13 | GPIO9 | + | GP_12 | GP_10 | RTC_INT | GP_11 | R3 | VR1 | =Xover | SDA | R4 | = | SCL | + | + | Pull-Ups | + | + | GND | TX | RX | + | U0 | RXI | TXO | Vcc | CTS | GND | +VIN- | U1 | - | +
bPlace: J.C. Woltz | Serge Sozonoff | + | - | +